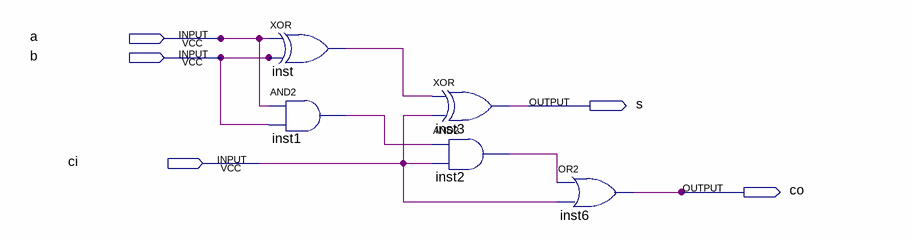
[diagram p0: schematic sheet]
// Quartus schematic lab1.bdf as structural Verilog: 5 symbols, 5 pins
module lab1 (
  input  a,
  input  b,
  input  ci,
  output s,
  output co
);

  wire inst1_out, inst2_out, inst_out;

  xor inst (inst_out, a, b);
  and inst1 (inst1_out, a, b);
  xor inst3 (s, inst_out, ci);
  and inst2 (inst2_out, inst1_out, ci);
  or inst6 (co, inst2_out, ci);
endmodule
